# EAGLE design jeet (EAGLE 9.6.2)
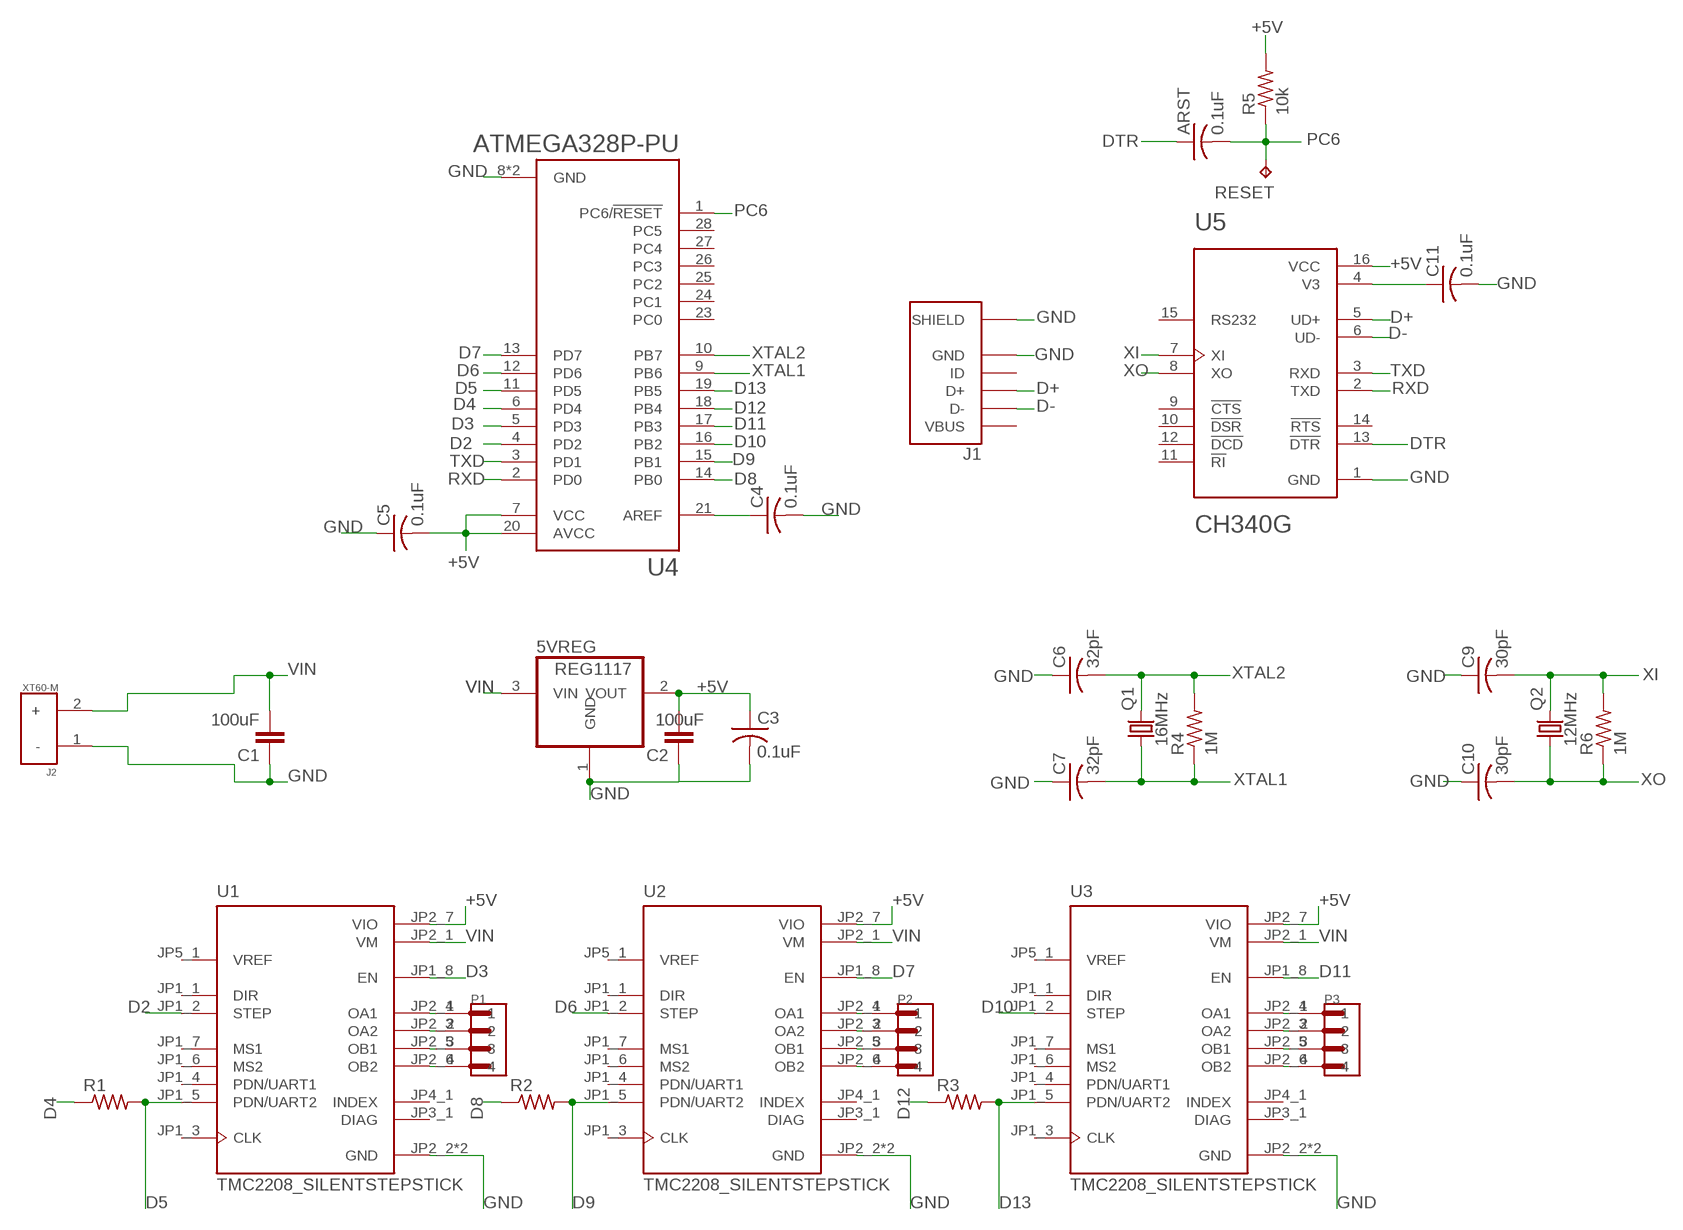
[diagram p0: schematic, sheet 1]

## Parts
5VREG  REG1117  [SOT223]
ARST  0.1uF  C-USC0805  [C0805]
C1  100uF  C2,5-3  [C2.5-3]
C2  100uF  C2,5-3  [C2.5-3]
C3  0.1uF  C-USC0805  [C0805]
C4  0.1uF  C-USC0805  [C0805]
C5  0.1uF  C-USC0805  [C0805]
C6  32pF  C-USC0805  [C0805]
C7  32pF  C-USC0805  [C0805]
C9  30pF  C-USC0805  [C0805]
C10  30pF  C-USC0805  [C0805]
C11  0.1uF  C-USC0805  [C0805]
J1  USB2066-05-RBHM-XX-STB-00-00-A_REVD  [GCT_USB2066-05-RBHM-XX-STB-00-00-A_REVD]
J2  XT60-M  [AMASS_XT60-M]
P1  S4B-XH-A(LF)(SN)  [JST_S4B-XH-A(LF)(SN)]
P2  S4B-XH-A(LF)(SN)  [JST_S4B-XH-A(LF)(SN)]
P3  S4B-XH-A(LF)(SN)  [JST_S4B-XH-A(LF)(SN)]
Q1  16MHz  CRYSTALHC49S  [HC49/S]
Q2  12MHz  CRYSTALHC49S  [HC49/S]
R1  R-US_R0805  [R0805]
R2  R-US_R0805  [R0805]
R3  R-US_R0805  [R0805]
R4  1M  R-US_R0805  [R0805]
R5  10k  R-US_R0805  [R0805]
R6  1M  R-US_R0805  [R0805]
RESET  TPB1,27  [B1,27]
U1  TMC2208_SILENTSTEPSTICK  [MODULE_TMC2208_SILENTSTEPSTICK]
U2  TMC2208_SILENTSTEPSTICK  [MODULE_TMC2208_SILENTSTEPSTICK]
U3  TMC2208_SILENTSTEPSTICK  [MODULE_TMC2208_SILENTSTEPSTICK]
U4  ATMEGA328P-PU  [DIP794W46P254L2967H457Q28B]
U5  CH340G  [SOIC127P600X180-16N]

## Nets
+5V: 5VREG.2(VOUT) C2.2 C3.1 C5.2 R5.2 U1.JP2_7(VIO) U2.JP2_7(VIO) U3.JP2_7(VIO) U4.7(VCC) U4.20(AVCC) U5.16(VCC)
D2: U1.JP1_2(STEP) U4.4(PD2)
D3: U1.JP1_8(EN) U4.5(PD3)
D4: R1.1 U4.6(PD4)
D5: R1.2 U1.JP1_5(PDN/UART2) U4.11(PD5)
D6: U2.JP1_2(STEP) U4.12(PD6)
D7: U2.JP1_8(EN) U4.13(PD7)
D8: R2.1 U4.14(PB0)
D9: R2.2 U2.JP1_5(PDN/UART2) U4.15(PB1)
D10: U3.JP1_2(STEP) U4.16(PB2)
D11: U3.JP1_8(EN) U4.17(PB3)
D12: R3.1 U4.18(PB4)
D13: R3.2 U3.JP1_5(PDN/UART2) U4.19(PB5)
D+: J1.3(D+) U5.5(UD+)
D-: J1.2(D-) U5.6(UD-)
DTR: ARST.1 U5.13(!DTR)
GND [PWR]: 5VREG.1(GND) C1.1 C2.1 C3.2 C4.2 C5.1 C6.1 C7.1 C9.1 C10.1 C11.2 J1.5(GND) J1.6(SHIELD) J1.7(SHIELD) J1.8(SHIELD) J1.9(SHIELD) J2.1(-) U1.JP2_2(GND) U1.JP2_8(GND) U2.JP2_2(GND) U2.JP2_8(GND) U3.JP2_2(GND) U3.JP2_8(GND) U4.8(GND) U4.22(GND) U5.1(GND)
N$1: P1.1 U1.JP2_4(OA1)
N$2: P1.2 U1.JP2_3(OA2)
N$3: P1.3 U1.JP2_5(OB1)
N$4: P1.4 U1.JP2_6(OB2)
N$5: P2.1 U2.JP2_4(OA1)
N$6: P2.2 U2.JP2_3(OA2)
N$7: P2.3 U2.JP2_5(OB1)
N$8: P2.4 U2.JP2_6(OB2)
N$9: P3.1 U3.JP2_4(OA1)
N$10: P3.2 U3.JP2_3(OA2)
N$11: P3.3 U3.JP2_5(OB1)
N$12: P3.4 U3.JP2_6(OB2)
N$13: C4.1 U4.21(AREF)
N$14: C11.1 U5.4(V3)
PC6: ARST.2 R5.1 RESET.TP U4.1(PC6/!RESET)
RXD: U4.2(PD0) U5.2(TXD)
TXD: U4.3(PD1) U5.3(RXD)
VIN [PWR]: 5VREG.3(VIN) C1.2 J2.2(+) U1.JP2_1(VM) U2.JP2_1(VM) U3.JP2_1(VM)
XI: C9.2 Q2.2 R6.2 U5.7(XI)
XO: C10.2 Q2.1 R6.1 U5.8(XO)
XTAL1: C7.2 Q1.1 R4.1 U4.9(PB6)
XTAL2: C6.2 Q1.2 R4.2 U4.10(PB7)
Unconnected: J1.4(ID) U1.JP1_1(DIR) U1.JP1_3(CLK) U1.JP1_4(PDN/UART1) U1.JP1_6(MS2) U1.JP1_7(MS1) U1.JP3_1(DIAG) U1.JP4_1(INDEX) U1.JP5_1(VREF) U2.JP1_1(DIR) U2.JP1_3(CLK) U2.JP1_4(PDN/UART1) U2.JP1_6(MS2) U2.JP1_7(MS1) U2.JP3_1(DIAG) U2.JP4_1(INDEX) U2.JP5_1(VREF) U3.JP1_1(DIR) U3.JP1_3(CLK) U3.JP1_4(PDN/UART1) U3.JP1_6(MS2) U3.JP1_7(MS1) U3.JP3_1(DIAG) U3.JP4_1(INDEX) U3.JP5_1(VREF) U4.23(PC0) U4.24(PC1) U4.25(PC2) U4.26(PC3) U4.27(PC4) U4.28(PC5) U5.9(!CTS) U5.10(!DSR) U5.11(!RI) U5.12(!DCD) U5.14(!RTS) U5.15(RS232)

## Power pins joined to a net without a drawn wire
VBUS: J1.1(VBUS)

## Library data of the parts
5VREG = burr-brown:REG1117: 800mA and 1A Low Dropout (LDO) Positive Regulator 1.8V, 2.5V, 2.85V, 3.3V, 5V, and Adj; MPN: REG1117; OC_FARNELL: 1097566; OC_NEWARK: 14P6981
ARST C3-C7 C9-C11 = adafruit:C-US: CAPACITOR, American symbol
C1 C2 = capacitor-wima:C: CAPACITOR naming: grid - package width
J1 = USB2066-05-RBHM-XX-STB-00-00-A_REVD:USB2066-05-RBHM-XX-STB-00-00-A_REVD: Mimi USB Receptacle, Type B, 5 Pin, SMT, Horizontal, Optional Post, 9.40mm Length Check availability <https://pricing.snapeda.com/parts/USB2066-05-RBHM-15-STB-00-00-A/Global%20Connector%20Technology/view-part?ref=eda>; AVAILABILITY: In Stock; DESCRIPTION: USB - mini B USB 2.0 Receptacle Connector 5 Position Surface Mount, Right Angle; MF: Global Connector Technology; MP: USB2066-05-RBHM-15-STB-00-00-A; PACKAGE: None; PRICE: None; PURCHASE-URL: https://pricing.snapeda.com/search/part/USB2066-05-RBHM-15-STB-00-00-A/?ref=eda
J2 = XT60-M:XT60-M: DC supply; XT60; male; PIN:2; for cable; soldered; 60A; 500V Check availability <https://pricing.snapeda.com/parts/XT60-M/AMASS/view-part?ref=eda>; AVAILABILITY: Not in stock; DESCRIPTION: Plug; DC supply; XT60; male; PIN: 2; for cable; soldered; 30A; 500V; MF: AMASS; MP: XT60-M; PACKAGE: Package; PRICE: None
P1-P3 = S4B-XH-A_LF__SN_:S4B-XH-A(LF)(SN): XH Series 4 Position 2.5 mm Through Hole Right Angle Press Fit Shrouded Header Check availability <https://pricing.snapeda.com/parts/S4B-XH-A%28LF%29%28SN%29/JST%20Sales/view-part?ref=eda>; AVAILABILITY: In Stock; DESCRIPTION: Connector Header Through Hole, Right Angle 4 position 0.098 (2.50mm); MF: JST Sales; MP: S4B-XH-A(LF)(SN); PACKAGE: None; PRICE: None
Q1 Q2 = adafruit:CRYSTAL: CRYSTAL; OC_FARNELL: 1667008; OC_NEWARK: unknown
R1-R6 = adafruit:R-US_: RESISTOR, American symbol
RESET = testpad:TP: Test pad
U1-U3 = TMC2208_SILENTSTEPSTICK:TMC2208_SILENTSTEPSTICK: TMC2208 Motor Controller/Driver, Stepper Power Management Evaluation Board Check prices <https://pricing.snapeda.com/parts/TMC2208%20SILENTSTEPSTICK/Trinamic%20Motion/view-part?ref=eda>; AVAILABILITY: In Stock; DESCRIPTION: TMC2208 Motor Controller/Driver, Stepper Power Management Evaluation Board; MF: Trinamic Motion; MP: TMC2208 SILENTSTEPSTICK; PACKAGE: None; PRICE: None
U4 = ATMEGA328P-PU:ATMEGA328P-PU: ATmega Series 20 MHz 32 KB Flash 2 KB SRAM 8-Bit Microcontroller - DIP-28 Check availability <https://pricing.snapeda.com/parts/ATMEGA328P-PU/Microchip%20Technology/view-part?ref=eda>; AVAILABILITY: In Stock; DESCRIPTION: AVR AVR® ATmega Microcontroller IC 8-Bit 20MHz 32KB (16K x 16) FLASH 28-PDIP; MF: Microchip Technology; MP: ATMEGA328P-PU; PACKAGE: DIP-28 Microchip Technology; PRICE: None; PURCHASE-URL: https://pricing.snapeda.com/search/part/ATMEGA328P-PU/?ref=eda
U5 = CH340G:CH340G: Check availability <https://pricing.snapeda.com/parts/Ch340G/WCH/view-part?ref=eda>; AVAILABILITY: In Stock; DESCRIPTION: USB Interface Integrated Circuit; MF: WCH; MP: Ch340G; PACKAGE: None; PRICE: None

## Net classes
0 default: width 0.2 mm, drill 0.2 mm, clearance 0.2 mm
1 PWR: width 2.032 mm, drill 2.032 mm, clearance 0.2 mm

## Board
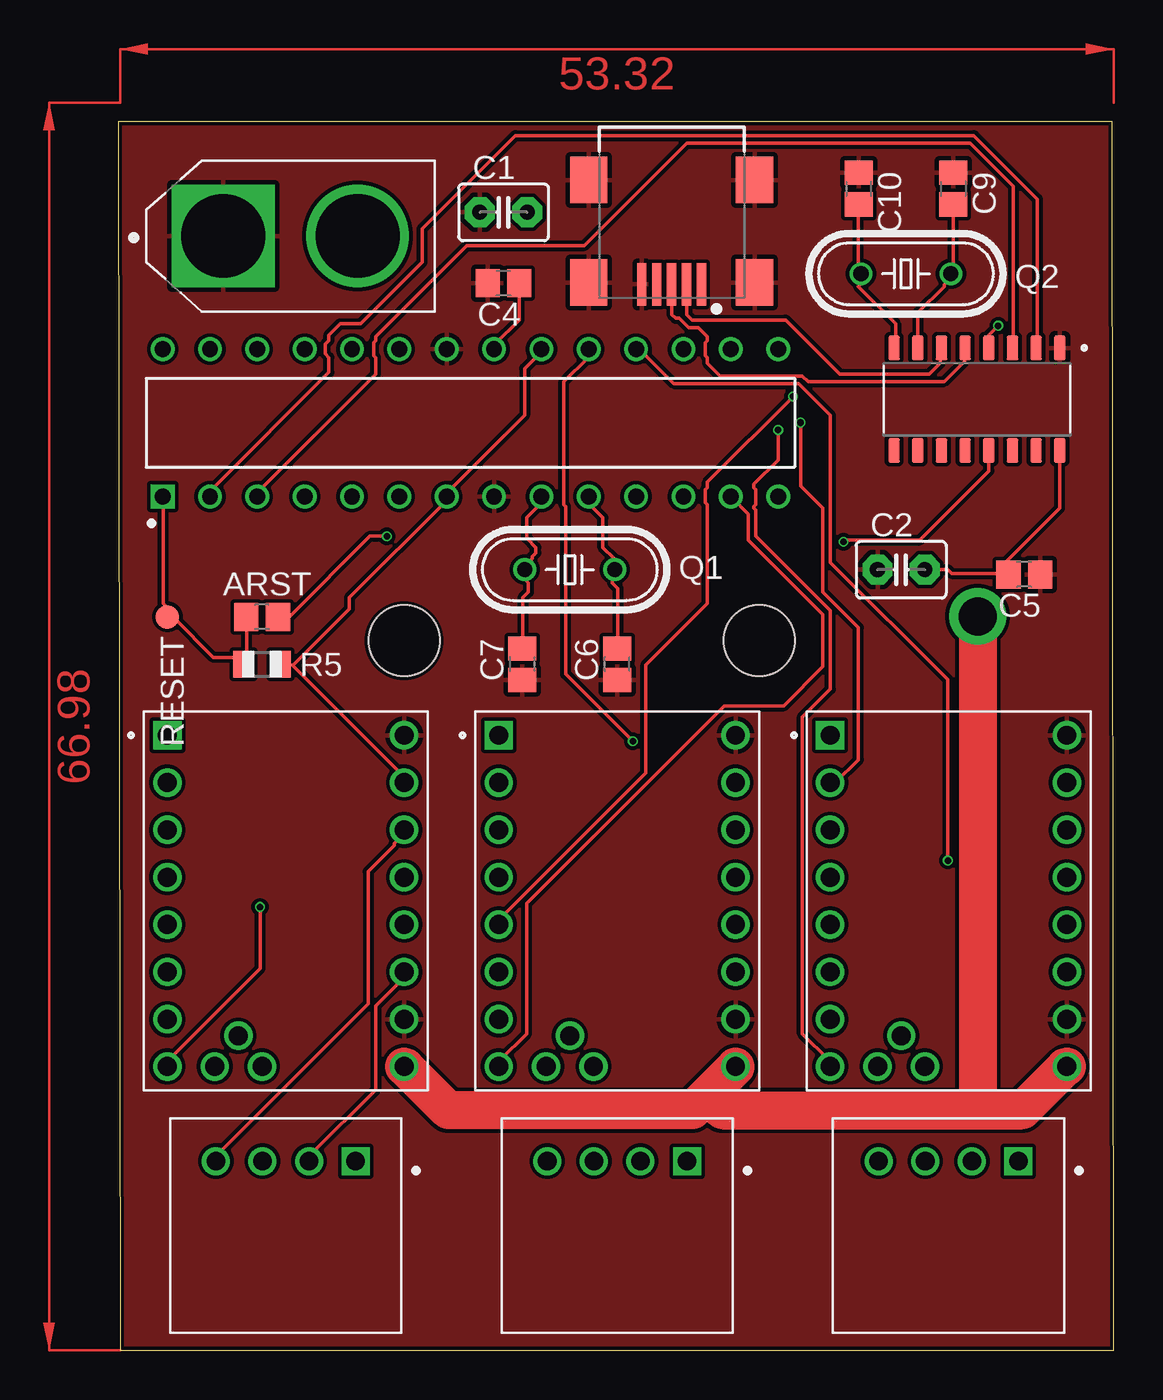
[diagram p1: board, top side]
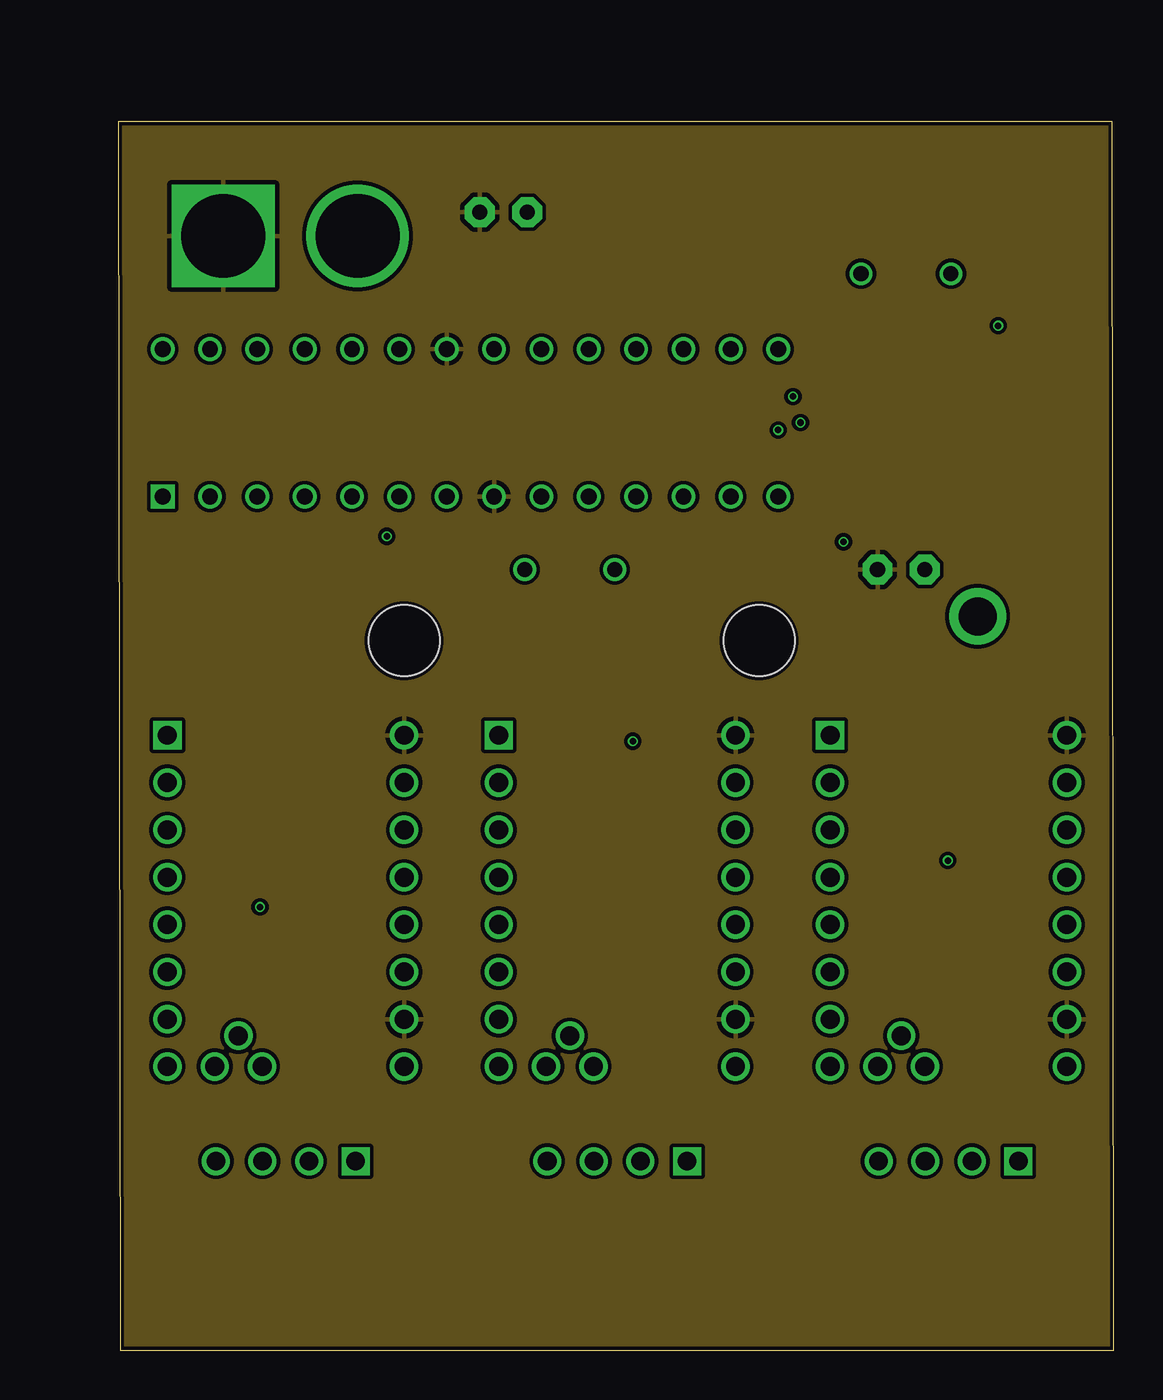
[diagram p2: board, inner layer Route2]
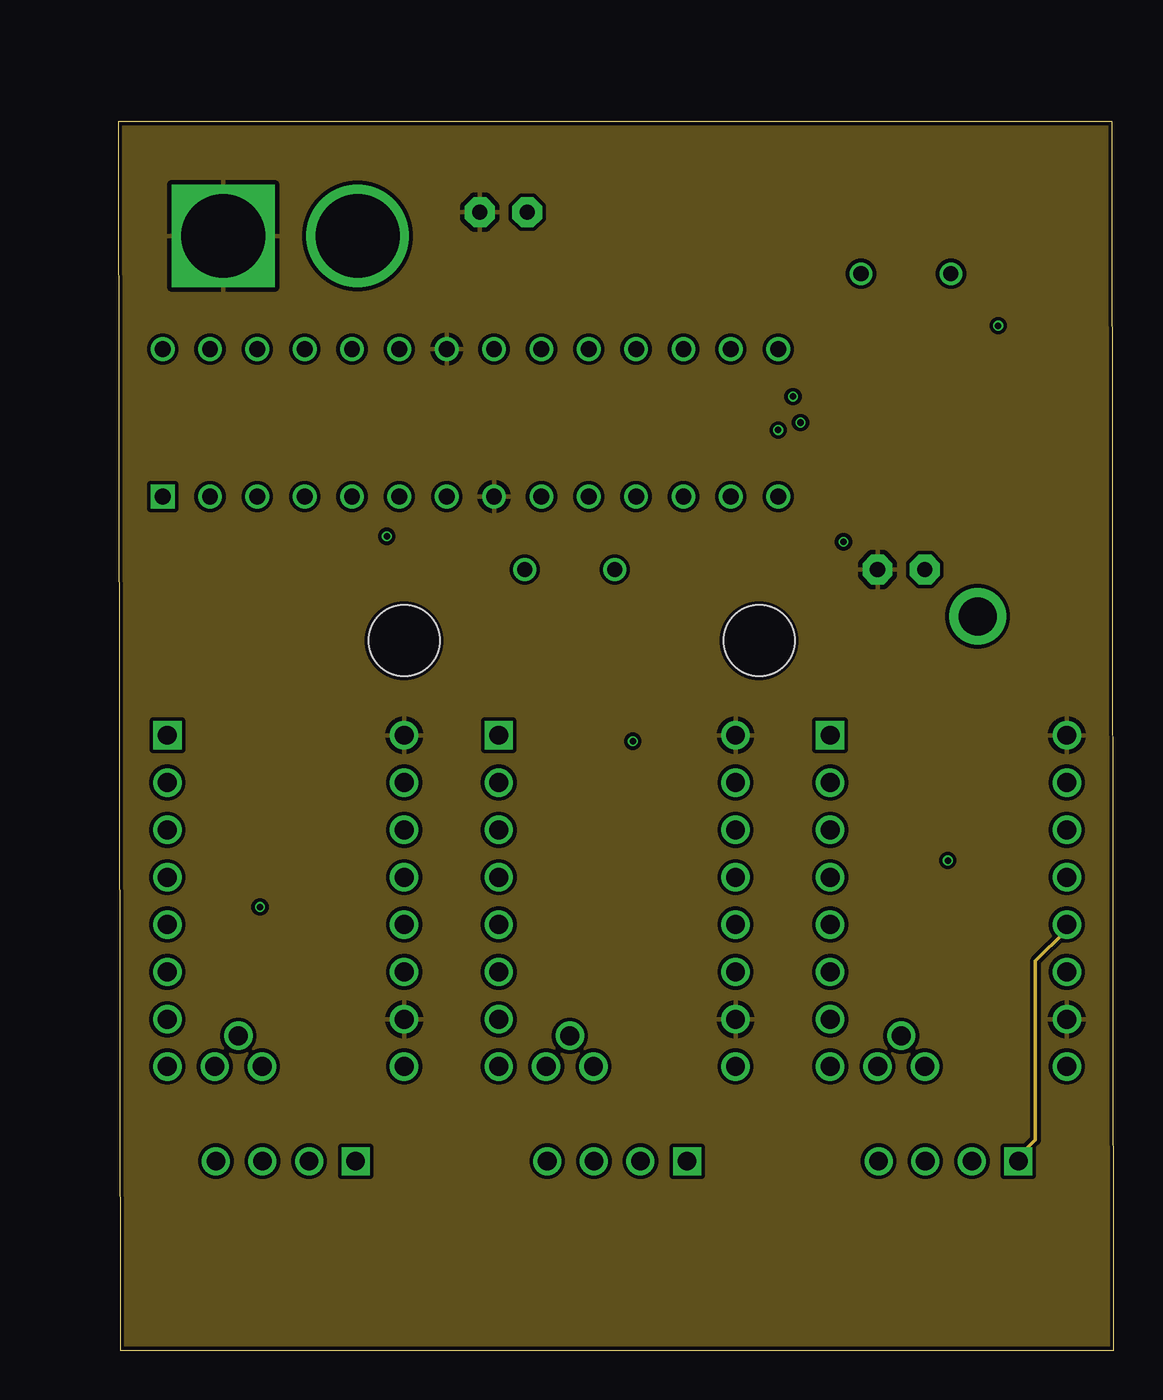
[diagram p3: board, inner layer Route15]
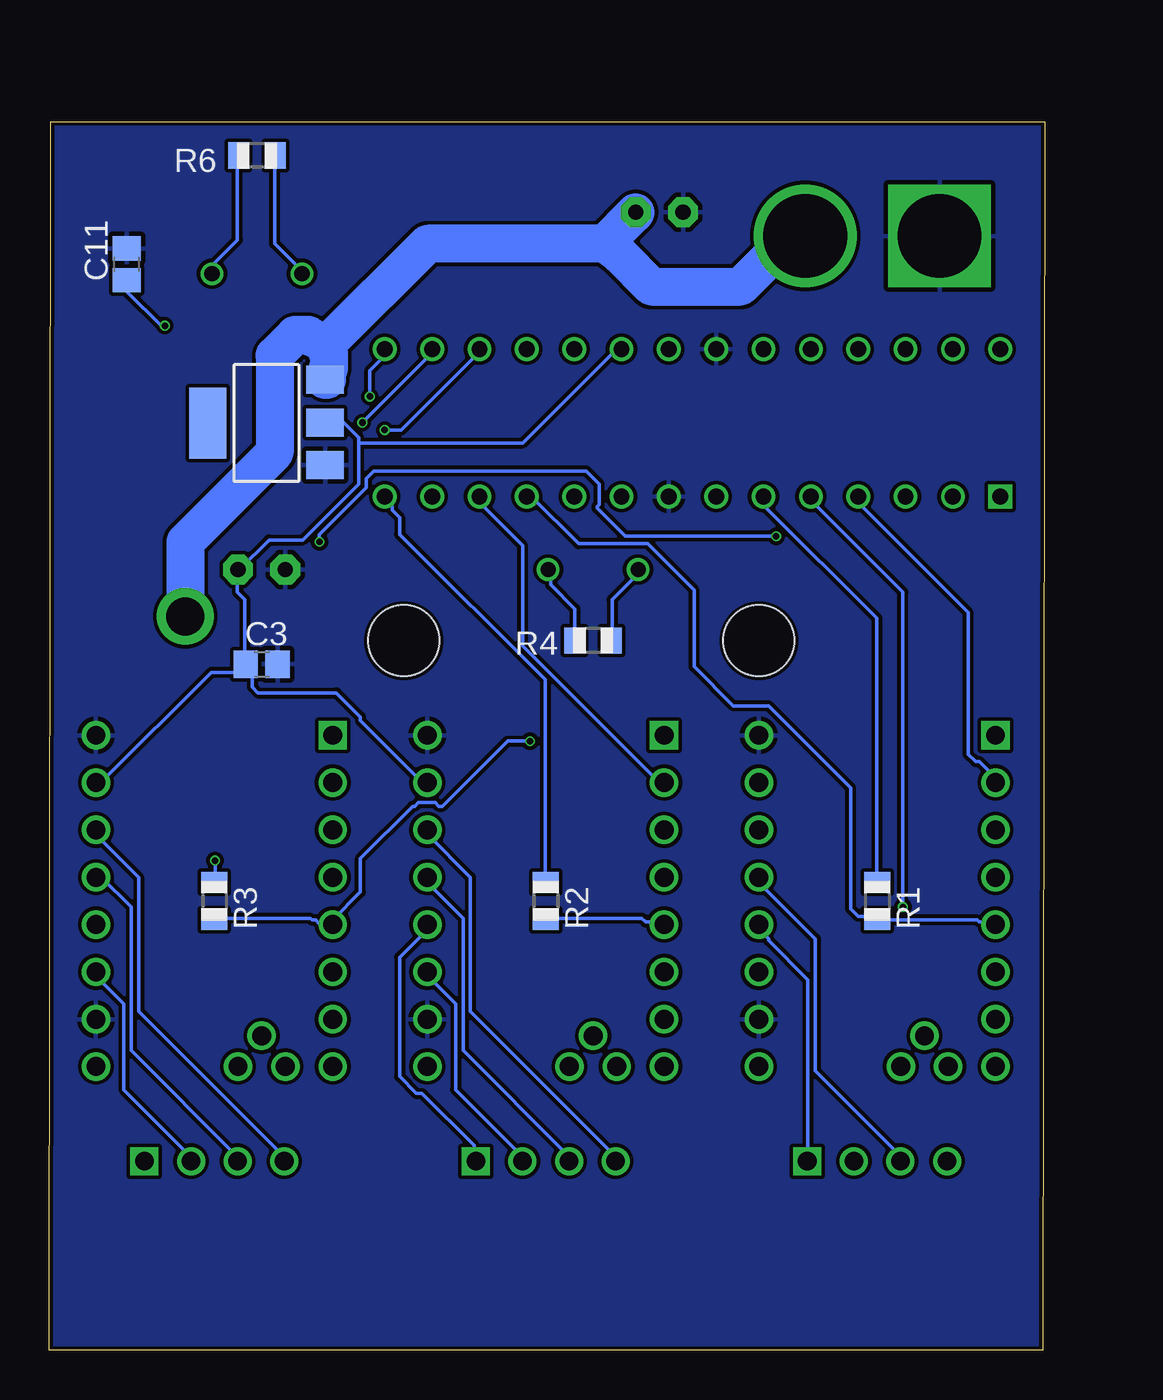
[diagram p4: board, bottom side, seen from below]

Size 53.42 x 65.94 mm. Coordinates in mm from the lower left corner, seen from the top.
Outline: 0.1,0 53.42,0 53.34,65.94 0,65.94 0.1,0
Copper layers (1+2*15+16): Top 0.035559375mm / dielectric 1.6mm / Route2 0.0356mm / dielectric 0.1499mm / Route15 0.0356mm / dielectric 0.2007mm / Bottom 0.035559375mm
Design rules "jlcpcb2layer *": minimum track width 5mil, minimum drill 12mil, track to track 5mil, track to pad 5mil, pad to pad 5mil, via to via 5mil, smd to smd 5mil, copper to edge 8mil, drill to drill 6mil, minimum pad ring 5mil, minimum via ring 3mil, stop-mask expansion 2.5mil, vias tented up to drill 0mil, thermal gap 10mil
Holes 3.81 mm at 15.34,38.1 34.39,38.1

### Footprints (pad centres in the part's own frame; a part is rotated, then mirrored left to right if it is on the bottom)
SOT223 = smd 1.499 x 2.007: 1 -2.261,-3.15; 2 0.025,-3.15; 3 2.311,-3.15 | smd 3.81 x 2.007: 4 0,3.15
C0805 = smd 1.3 x 1.5: 1 -0.85,0; 2 0.85,0
C2.5-3 = drill 0.813 pad 1.6 octagon: 1 -1.27,0; 2 1.27,0
GCT_USB2066-05-RBHM-XX-STB-00-00-A_REVD = smd 0.5 x 2.3: 1 -1.6,2.6; 2 -0.8,2.6; 3 0,2.6; 4 0.8,2.6; 5 1.6,2.6 | smd 2 x 2.5: 6 4.45,-3; 7 4.45,2.5; 8 -4.45,-3; 9 -4.45,2.5
AMASS_XT60-M = drill 4.5 square: 1 -3.6,0 | drill 4.5: 2 3.6,0
JST_S4B-XH-A(LF)(SN) = drill 1 square: 1 -3.75,0 | drill 1: 2 -1.25,0; 3 1.25,0; 4 3.75,0
HC49/S = drill 0.813: 1 -2.413,0; 2 2.413,0
R0805 = smd 1.1 x 1.4: 1 -1,0; 2 1,0
B1,27 = smd 1.27 x 1.27: TP 0,0
MODULE_TMC2208_SILENTSTEPSTICK = drill 1.016 square: JP1_1 -6.35,8.89 | drill 1.016: JP1_2 -6.35,6.35; JP1_3 -6.35,3.81; JP1_4 -6.35,1.27; JP1_5 -6.35,-1.27; JP1_6 -6.35,-3.81; JP1_7 -6.35,-6.35; JP1_8 -6.35,-8.89; JP2_1 6.35,-8.89; JP2_2 6.35,-6.35; JP2_3 6.35,-3.81; JP2_4 6.35,-1.27; JP2_5 6.35,1.27; JP2_6 6.35,3.81; JP2_7 6.35,6.35; JP2_8 6.35,8.89; JP3_1 -2.54,-7.239; JP4_1 -1.27,-8.89; JP5_1 -3.81,-8.89
DIP794W46P254L2967H457Q28B = drill 0.85 square: 1 -3.96,16.51 | drill 0.85: 2 -3.96,13.97; 3 -3.96,11.43; 4 -3.96,8.89; 5 -3.96,6.35; 6 -3.96,3.81; 7 -3.96,1.27; 8 -3.96,-1.27; 9 -3.96,-3.81; 10 -3.96,-6.35; 11 -3.96,-8.89; 12 -3.96,-11.43; 13 -3.96,-13.97; 14 -3.96,-16.51; 15 3.96,-16.51; 16 3.96,-13.97; 17 3.96,-11.43; 18 3.96,-8.89; 19 3.96,-6.35; 20 3.96,-3.81; 21 3.96,-1.27; 22 3.96,1.27; 23 3.96,3.81; 24 3.96,6.35; 25 3.96,8.89; 26 3.96,11.43; 27 3.96,13.97; 28 3.96,16.51
SOIC127P600X180-16N = smd 1.31 x 0.62: 1 -2.75,4.445; 2 -2.75,3.175; 3 -2.75,1.905; 4 -2.75,0.635; 5 -2.75,-0.635; 6 -2.75,-1.905; 7 -2.75,-3.175; 8 -2.75,-4.445; 9 2.75,-4.445; 10 2.75,-3.175; 11 2.75,-1.905; 12 2.75,-0.635; 13 2.75,0.635; 14 2.75,1.905; 15 2.75,3.175; 16 2.75,4.445

### Placement (x,y rotation side)
5VREG  41.76,49.78 90 bottom
ARST  7.72,39.37 180 top
C1  20.68,61.09 0 top
C2  42.01,41.91 0 top
C3  42.01,36.83 0 bottom
C4  20.68,57.28 180 top
C5  48.62,41.66 180 top
C6  26.77,36.83 90 top
C7  21.69,36.83 90 top
C9  44.81,62.36 270 top
C10  39.73,62.36 270 top
C11  49.25,58.29 90 bottom
J1  29.69,59.82 180 top
J2  9.25,59.82 0 top
P1  8.99,10.16 180 top
P2  26.77,10.16 180 top
P3  44.55,10.16 180 top
Q1  24.23,41.91 0 top
Q2  42.27,57.78 0 top
R1  8.99,24.13 270 bottom
R2  26.77,24.13 270 bottom
R3  44.55,24.13 270 bottom
R4  24.23,38.1 180 bottom
R5  7.72,36.83 0 top
R6  42.27,64.14 180 bottom
RESET  2.64,39.37 0 top
U1  8.99,24.13 0 top
U2  26.77,24.13 0 top
U3  44.55,24.13 0 top
U4  18.9,49.78 90 top
U5  46.08,51.05 270 top

### Tracks (layer width: path | path; a pad name or v marks a point on that pad's centre or on a via)
+5V
  Top 0.2: 9.36,36.75 15.31,30.8 15.31,30.5 U1.JP2_7 | 9.36,36.75 9.31,36.8 8.81,36.8 R5.2 | U4.20 22.61,53.7 22.61,53.5 21.81,52.7 21.81,50.2 17.71,46.1 17.71,45.9 U4.7 17.61,45.8 17.61,45.6 12.41,40.4 12.41,39.8 9.36,36.75 | U5.16 50.51,45.2 47.71,42.4 47.71,41.7 C5.2 47.61,41.7 44.71,41.7 44.51,41.9 43.31,41.9 C2.2
  Bottom 0.2: C3.1 42.91,36.9 42.91,40.3 43.31,40.7 43.31,41.9 C2.2 43.21,41.9 41.61,43.5 39.81,43.5 36.81,46.5 36.81,48.7 | 36.81,48.7 36.81,49 37.61,49.8 38.51,49.8 5VREG.2 | U2.JP2_7 33.21,30.5 33.41,30.5 36.71,33.8 36.71,34 38.01,35.3 42.21,35.3 42.51,35.6 42.51,36.5 42.81,36.8 C3.1 | U3.JP2_7 50.81,30.5 50.61,30.5 44.71,36.4 43.31,36.4 42.91,36.8 C3.1 | 36.81,48.7 28.01,48.7 23.01,53.7 22.71,53.7 U4.20
D2
  Bottom 0.2: U4.4 9.91,45.8 9.91,45.4 4.11,39.6 4.11,32 3.71,31.6 3.51,31.6 2.71,30.8 2.71,30.5 U1.JP1_2
D3  (via drill 0.35)
  Top 0.2: v7.61,23.8 7.61,20.5 2.71,15.6 2.71,15.3 U1.JP1_8
  Bottom 0.2: v7.61,23.8 7.61,40.7 12.51,45.6 12.51,45.8 U4.5
D4
  Bottom 0.2: R1.1 9.01,25.2 9.01,39.3 15.01,45.3 15.01,45.8 U4.6
D5
  Bottom 0.2: U1.JP1_5 2.71,22.9 3.31,22.9 3.41,23 3.51,23 3.61,23.1 8.91,23.1 R1.2 9.01,23.2 9.11,23.3 10.01,23.3 10.41,23.7 10.41,30.2 14.81,34.6 16.71,34.6 18.81,36.7 18.81,40.8 21.31,43.3 25.01,43.3 27.51,45.8 27.71,45.8 U4.11
D6
  Bottom 0.2: U4.12 30.31,45.8 30.31,45.5 28.01,43.2 28.01,37.8 20.71,30.5 20.51,30.5 U2.JP1_2
D7
  Top 0.2: U4.13 32.91,45.8 33.81,44.9 33.81,43.5 37.81,39.5 37.81,36.7 35.71,34.6 32.51,34.6 21.91,24 21.91,17 20.51,15.6 20.51,15.3 U2.JP1_8
D8
  Bottom 0.2: R2.1 26.81,25.2 26.81,36 34.61,43.8 34.61,44.7 35.01,45.1 35.01,45.3 35.31,45.6 35.31,45.8 U4.14
D9  (via drill 0.35)
  Top 0.2: v36.21,51.2 31.61,46.6 31.61,46.3 31.51,46.2 31.51,45.5 31.61,45.4 31.61,40.1 28.31,36.8 28.31,31 20.51,23.2 20.51,22.9 U2.JP1_5
  Bottom 0.2: R2.2 26.71,23.2 21.61,23.2 21.41,23 21.21,23 21.11,22.9 20.51,22.9 U2.JP1_5 | v36.21,51.2 36.21,52.6 35.41,53.4 35.41,53.7 U4.15
D10  (via drill 0.35)
  Top 0.2: v36.61,49.8 36.61,46.4 37.81,45.2 37.81,40.7 39.71,38.8 39.71,31.7 38.51,30.5 38.21,30.5 U3.JP1_2
  Bottom 0.2: v36.61,49.8 32.91,53.5 32.91,53.7 U4.16
D11  (via drill 0.35)
  Top 0.2: v35.41,49.4 35.41,47.8 34.11,46.5 34.11,46.3 34.21,46.2 34.21,45.4 34.11,45.3 34.11,45.2 34.21,45.1 34.21,43.7 38.21,39.7 38.21,35.5 36.71,34 36.71,17 38.11,15.6 38.11,15.3 U3.JP1_8
  Bottom 0.2: v35.41,49.4 34.51,49.4 30.41,53.5 30.41,53.7 U4.17
D12  (via drill 0.35)
  Top 0.2: v44.51,26.3 44.51,36 38.21,42.3 38.21,50.2 36.51,51.9 29.81,51.9 28.01,53.7 27.81,53.7 U4.18
  Bottom 0.2: v44.51,26.3 44.51,25.2 R3.1
D13  (via drill 0.35)
  Top 0.2: v27.61,32.7 24.01,36.3 24.01,45.3 23.91,45.4 23.91,52 25.21,53.3 25.21,53.7 U4.19
  Bottom 0.2: R3.2 44.51,23.2 39.41,23.2 39.31,23.1 39.11,23.1 38.91,22.9 38.21,22.9 U3.JP1_5 38.21,23 38.21,23.1 36.71,24.6 36.71,26.4 33.91,29.2 33.81,29.2 33.61,29.4 32.71,29.4 32.51,29.2 32.31,29.2 28.81,32.7 v27.61,32.7
D+
  Top 0.2: U5.5 45.41,53.8 45.41,53.1 44.31,52 37.01,52 36.71,52.3 32.31,52.3 31.61,53 31.61,53.3 31.51,53.4 31.51,54.1 31.61,54.2 31.61,54.4 31.11,54.9 30.61,54.9 30.11,55.4 29.91,55.4 29.71,55.6 29.71,57.2 J1.3
D-
  Top 0.2: U5.6 44.11,53.8 44.11,53 43.51,52.4 38.71,52.4 35.81,55.3 30.81,55.3 30.51,55.6 30.51,57.2 J1.2
DTR  (via drill 0.35)
  Top 0.2: v38.91,43.4 39.01,43.5 43.01,43.5 46.71,47.2 U5.13 | v14.41,43.7 13.51,43.7 9.21,39.4 8.61,39.4 ARST.1
  Bottom 0.2: v38.91,43.4 38.91,43.8 36.41,46.3 36.41,46.8 36.01,47.2 24.61,47.2 23.91,46.5 23.91,45.4 24.01,45.3 24.01,45.2 22.51,43.7 v14.41,43.7
GND
  pour Top: -2.44,68.58 -2.44,-1.27 0.1,-3.81 52.17,-3.81 55.98,0 55.98,68.58 54.71,69.85 -1.17,69.85
  pour Route2: -4.98,72.39 -4.98,-3.81 -1.17,-7.62 53.44,-7.62 59.79,-1.27 59.79,68.58 57.25,71.12 55.98,72.39
  pour Route15: -6.25,74.93 -6.25,-11.43 59.79,-11.43 64.87,-6.35 64.87,76.2 63.6,74.93
  pour Bottom: -11.33,60.96 -11.33,-8.89 -3.71,-16.51 61.06,-16.51 69.95,-7.62 69.95,78.74 68.68,80.01 7.72,80.01
N$1
  Bottom 0.2: P1.1 12.71,10.2 12.71,19.9 14.81,22 14.81,22.1 15.31,22.6 15.31,22.8 U1.JP2_4
N$2
  Top 0.2: P1.2 10.31,10.2 10.31,10.5 13.81,14 13.81,18.5 15.31,20 15.31,20.3 U1.JP2_3
N$3
  Bottom 0.2: P1.3 7.81,10.2 7.81,10.5 12.31,15 12.31,22.1 15.31,25.1 15.31,25.4 U1.JP2_5
N$4
  Top 0.2: P1.4 5.31,10.2 5.31,10.5 13.41,18.6 13.41,25.7 14.81,27.1 14.81,27.2 15.31,27.7 15.31,27.9 U1.JP2_6
N$5
  Bottom 0.2: P2.1 30.61,10.2 30.61,11 33.41,13.8 33.71,13.8 34.61,14.7 34.61,21.1 33.21,22.5 33.21,22.8 U2.JP2_4
N$6
  Bottom 0.2: P2.2 28.11,10.2 28.11,10.5 31.61,14 31.61,18.6 33.11,20.1 33.11,20.3 U2.JP2_3
N$7
  Bottom 0.2: P2.3 25.61,10.2 25.61,10.5 31.21,16.1 31.21,23.2 33.11,25.1 U2.JP2_5
N$8
  Bottom 0.2: P2.4 23.11,10.2 23.11,10.5 30.81,18.2 30.81,25.4 33.11,27.7 33.11,27.9 U2.JP2_6
N$9
  Route15 0.2: P3.1 48.31,10.2 48.31,10.4 49.21,11.3 49.21,20.9 50.81,22.5 50.81,22.8 U3.JP2_4
N$10
  Bottom 0.2: P3.2 45.81,10.2 45.81,10.4 49.41,14 49.41,18.6 50.81,20 50.81,20.3 U3.JP2_3
N$11
  Bottom 0.2: U3.JP2_5 50.61,25.4 49.01,23.8 49.01,16.1 43.31,10.4 43.31,10.2 P3.3
N$12
  Bottom 0.2: P3.4 40.81,10.2 40.81,10.4 48.61,18.2 48.61,25.4 50.81,27.6 50.81,27.9 U3.JP2_6
N$13
  Top 0.2: C4.1 21.51,57.2 21.51,55.3 20.21,54 20.21,53.8 U4.21
N$14  (via drill 0.35)
  Top 0.2: v47.21,55 46.71,54.5 46.71,53.9 U5.4
  Bottom 0.2: v47.21,55 47.41,55 49.21,56.8 49.21,57.4 C11.1
PC6
  Top 0.2: ARST.2 6.91,39.3 6.91,37.4 6.61,37.1 R5.1 6.71,36.9 6.41,37.2 5.11,37.2 3.01,39.3 2.71,39.3 RESET.TP 2.61,39.4 2.61,39.9 2.41,40.1 2.41,45.8 U4.1
RXD
  Top 0.2: U5.2 49.31,53.9 49.31,61.8 45.91,65.2 21.31,65.2 16.31,60.2 16.31,58.4 13.01,55.1 11.91,55.1 11.31,54.5 11.31,54.2 11.11,54 11.11,53.5 11.31,53.3 11.31,52.5 5.01,46.2 5.01,45.9 U4.2
TXD
  Top 0.2: U5.3 48.01,53.9 48.01,62.5 45.71,64.8 30.51,64.8 25.01,59.3 18.71,59.3 13.81,54.4 13.81,54.2 13.71,54.1 13.71,53.4 13.81,53.3 13.81,52.4 7.51,46.1 7.51,45.9 U4.3
VIN  (via drill 2.03)
  Top 2.032: 31.61,13.7 33.11,15.2 U2.JP2_1 | 31.61,13.7 30.81,12.9 17.71,12.9 15.41,15.2 U1.JP2_1 | 46.11,12.9 32.41,12.9 31.61,13.7 | 46.11,12.9 48.51,12.9 50.81,15.2 U3.JP2_1 | v46.11,39.4 46.11,12.9
  Bottom 2.032: 38.51,54 38.51,53.6 38.41,53.5 38.41,52.7 38.51,52.6 38.51,52.1 5VREG.3 | 38.51,54 33.11,59.4 23.61,59.4 | 23.61,59.4 22.01,61 C1.2 | J2.2 12.91,59.8 13.61,59.8 16.31,57.1 21.11,57.1 22.81,58.8 23.61,59.4 | v46.11,39.4 46.11,43.4 41.31,48.2 41.31,53.4 40.21,54.5 39.51,54.5 39.41,54.4 38.51,54
XI
  Top 0.2: U5.7 42.91,53.9 42.91,55.7 44.31,57.1 44.31,57.2 44.61,57.5 44.61,57.7 Q2.2 44.71,57.8 44.81,57.9 C9.2
  Bottom 0.2: R6.2 43.31,64.1 43.31,59.6 44.61,58.3 44.61,57.8 Q2.2
XO
  Top 0.2: U5.8 41.71,53.9 41.71,55.1 39.71,57.1 39.81,57.2 39.81,57.7 Q2.1 39.71,57.7 C10.2
  Bottom 0.2: R6.1 41.31,64.1 41.31,59.4 39.91,58 39.91,57.8 Q2.1
XTAL1
  Top 0.2: C7.2 21.71,37.7 21.71,40.4 22.01,40.7 22.01,41.2 21.91,41.3 21.91,41.9 Q1.1 21.91,42 21.91,42.2 22.21,42.5 22.21,42.6 22.41,42.8 22.41,43.1 21.91,43.6 21.91,44.7 22.61,45.4 22.61,45.8 U4.9
  Bottom 0.2: R4.1 23.21,38.1 23.21,40.3 21.91,41.6 21.91,41.9 Q1.1
XTAL2
  Top 0.2: C6.2 26.81,37.7 26.81,40.9 26.51,41.2 26.51,41.8 26.61,41.9 Q1.2 26.61,42 26.61,42.5 26.01,43.1 26.01,44.7 25.31,45.4 25.31,45.8 U4.10
  Bottom 0.2: R4.2 25.21,38.1 25.21,39.8 26.51,41.1 26.51,41.8 26.61,41.9 Q1.2
(copper drawn outside any net)
  shapes: Top area x2